# Altium schematic sheet NRF2401.SchDoc: NRF24L01-TX
size A4; SheetNumber: 3; SheetTotal: 5; DOC_NO_SCH_DWG: #022024031002
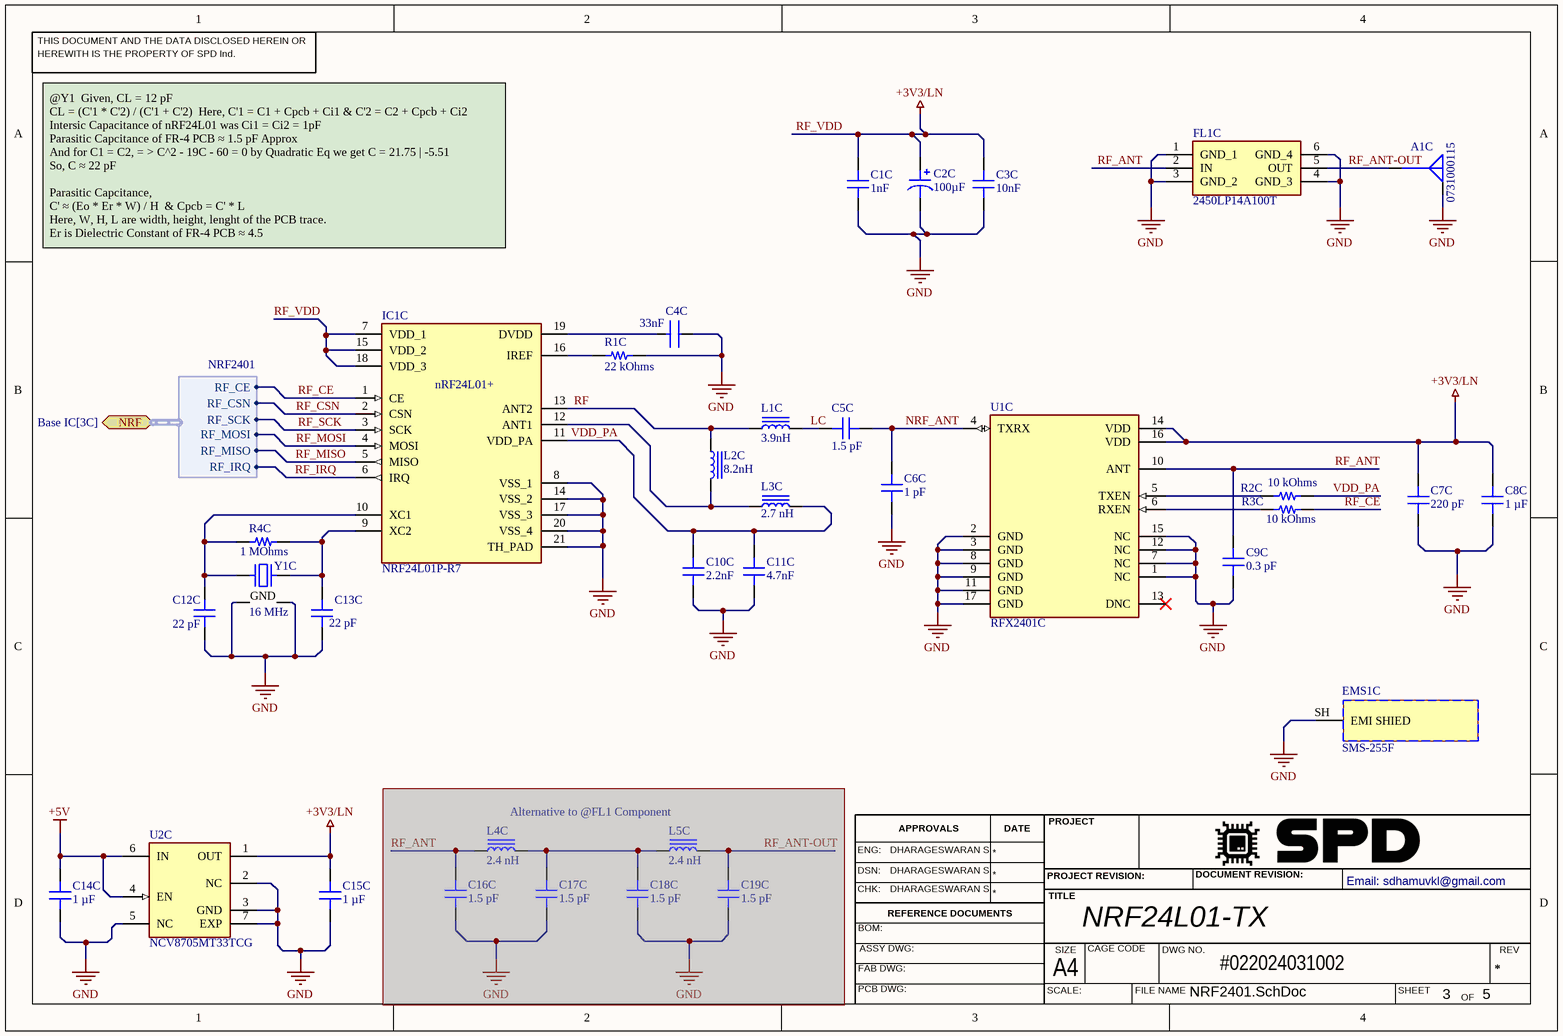
[diagram p0: NRF2401.SchDoc]

## Parts
A1C  0731000115  [MOLEX SD-73100-0115]
C1C  1nF  [CAP 0402_1005]
C2C  100µF  [CAP POL 1411_3528]
C3C  10nF  [CAP 0402_1005]
C4C  Capacitance: 33nF  [FP-CL101-IPC_C]  (hidden comment: CL05B333KO5NNNC)
C5C  1.5 pF  [CAP 0402_1005]
C6C  1 pF  [CAP 0402_1005]
C7C  220 pF  [CAP 0402_1005]
C8C  1 µF  [CAP 0402_1005]
C9C  0.3 pF  [CAP 0402_1005]
C10C  2.2nF  [CAP 0402_1005]
C11C  4.7nF  [CAP 0402_1005]
C12C  22 pF  [CAP 0402_1005]
C13C  22 pF  [CAP 0402_1005]
C14C  1 µF  [CAP 0402_1005]
C15C  1 µF  [CAP 0402_1005]
C16C  1.5 pF  [CAP 0402_1005]  (masked out: inside a compile mask, not in the netlist)
C17C  1.5 pF  [CAP 0402_1005]  (masked out: inside a compile mask, not in the netlist)
C18C  1.5 pF  [CAP 0402_1005]  (masked out: inside a compile mask, not in the netlist)
C19C  1.5 pF  [CAP 0402_1005]  (masked out: inside a compile mask, not in the netlist)
EMS1C  SMS-255F  [LEADERTECH_SMS-255F]
FL1C  2450LP14A100T  [2450LP14A100T]
IC1C  NRF24L01P-R7  [QFN50P400X400X95-21N-D]
L1C  3.9nH  [IND 0603_1608 RF WW]
L2C  8.2nH  [IND 0603_1608 RF WW]
L3C  2.7 nH  [IND 0402_1005 RF WW]
L4C  2.4 nH  [IND 0402_1005 RF WW]  (masked out: inside a compile mask, not in the netlist)
L5C  2.4 nH  [IND 0402_1005 RF WW]  (masked out: inside a compile mask, not in the netlist)
R1C  22 kOhms  [RES 0402_1005]
R2C  10 kOhms  [RES 0402_1005]
R3C  10 kOhms  [RES 0402_1005]
R4C  1 MOhms  [RES 0402_1005]
U1C  RFX2401C  [RFX2401C_SKY]
U2C  NCV8705MT33TCG  [FP-511BR-MFG]
Y1C  16 MHz  [NDK NX2520SA]

## Ports
NRF (bidir, harness NRF2401, see Base IC[3C])

## Harnesses
NRF2401: RF_CE, RF_CSN, RF_SCK, RF_MISO, RF_MOSI, RF_IRQ

## Nets
+5V: C14C.2 U2C.4(EN) U2C.6(IN)
GND: A1C.G C1C.1 C2C.2 C3C.1 C4C.2 C6C.1 C7C.1 C8C.2 C9C.1 C10C.1 C11C.1 C12C.1 C13C.1 C14C.1 C15C.1 EMS1C.SH(EMI_SHIED) FL1C.1(GND_1) FL1C.3(GND_2) FL1C.4(GND_3) FL1C.6(GND_4) IC1C.8(VSS_1) IC1C.14(VSS_2) IC1C.17(VSS_3) IC1C.20(VSS_4) IC1C.21(TH_PAD) R1C.1 U1C.1(NC) U1C.2(GND) U1C.3(GND) U1C.7(NC) U1C.8(GND) U1C.9(GND) U1C.11(GND) U1C.12(NC) U1C.15(NC) U1C.17(GND) U2C.2(NC) U2C.3(GND) U2C.5(NC) U2C.7(EXP) Y1C.2(GND) Y1C.4(GND)
RF_VDD: C1C.2 C2C.1 C3C.2 C7C.2 C8C.1 C15C.2 IC1C.7(VDD_1) IC1C.15(VDD_2) IC1C.18(VDD_3) U1C.14(VDD) U1C.16(VDD) U2C.1(OUT)  [also labelled +3V3/LN]
LC: C5C.1 L1C.2
NRF_ANT: C5C.2 C6C.2 U1C.4(TXRX)
RF: IC1C.13(ANT2) L1C.1 L2C.1
RF_ANT: C9C.2 FL1C.2(IN) U1C.10(ANT)
RF_ANT-OUT: A1C.S FL1C.5(OUT)
RF_CE: IC1C.1(CE) R3C.2 ; port NRF.RF_CE
RF_CSN: IC1C.2(CSN) ; port NRF.RF_CSN
RF_IRQ: IC1C.6(IRQ) ; port NRF.RF_IRQ
RF_MISO: IC1C.5(MISO) ; port NRF.RF_MISO
RF_MOSI: IC1C.4(MOSI) ; port NRF.RF_MOSI
RF_SCK: IC1C.3(SCK) ; port NRF.RF_SCK
VDD_PA: C10C.2 C11C.2 IC1C.11(VDD_PA) L3C.2 R2C.2
NetC4C_1: C4C.1 IC1C.19(DVDD)
NetC12C_2: C12C.2 IC1C.10(XC1) R4C.1 Y1C.1
NetC13C_2: C13C.2 IC1C.9(XC2) R4C.2 Y1C.3
NetIC1C_12: IC1C.12(ANT1) L2C.2 L3C.1
NetIC1C_16: IC1C.16(IREF) R1C.2
NetR2C_1: R2C.1 U1C.5(TXEN)
NetR3C_1: R3C.1 U1C.6(RXEN)

Not connected (* = marked no-connect by the designer): U1C 13(DNC)*

## Notes on the sheet
- @Y1  Given, CL = 12 pF
  CL = (C'1 * C'2) / (C'1 + C'2)  Here, C'1 = C1 + Cpcb + Ci1 & C'2 = C2 + Cpcb + Ci2
  Intersic Capacitance of nRF24L01 was Ci1 = Ci2 = 1pF
  Parasitic Capcitance of FR-4 PCB ≈ 1.5 pF Approx
  And for C1 = C2, = > C^2 - 19C - 60 = 0 by Quadratic Eq we get C = 21.75 | -5.51
  So, C ≈ 22 pF
  Parasitic Capcitance,
  C' ≈ (Eo * Er * W) / H  & Cpcb = C' * L
  Here, W, H, L are width, height, lenght of the PCB trace.
  Er is Dielectric Constant of FR-4 PCB ≈ 4.5
  So, C' ≈ 39.843 pF/m
- Alternative to @FL1 Component
- THIS DOCUMENT AND THE DATA DISCLOSED HEREIN OR
- HEREWITH IS THE PROPERTY OF SPD Ind.
- ENG:
- DHARAGESWARAN S
- APPROVALS
- DATE
- PROJECT
- DSN:
- CHK:
- REFERENCE DOCUMENTS
- PROJECT REVISION:
- TITLE
- DOCUMENT REVISION:
- Email: sdhamuvkl@gmail.com <https://github.com/DhamuVkl>
- BOM:
- FAB DWG:
- PCB DWG:
- ASSY DWG:
- SCALE:
- A4
- SIZE
- CAGE CODE
- FILE NAME
- DWG NO.
- SHEET
- REV
- OF
- (in symbol NRF24L01P-R7) nRF24L01+

## Library data of the parts
A1C = 0731000115: CONN SMA RCPT R/A 50 OHM PCB; Manufacturer: Molex; id: 4; Contact Termination: Solder; Connector Type: Receptacle, Female Socket; Number Of Ports: 1; Impedance: 50Ohm; Frequency - Max: 18 GHz; Part Number: 0731000115; Housing Color: Silver; Supplier Part Number 1: WM8552-ND; ComponentLink1Description: Datasheet; ComponentLink2URL: https://www.digikey.com/en/products/detail/molex/0731000115/3044674; ComponentLink1URL: https://www.molex.com/pdm_docs/sd/731000115_sd.pdf; Fastening Type: Threaded; Supplier 1: DigiKey; Series: 73100; Part Status: Active; Shield Termination: Solder; ComponentLink2Description: DigiKey Link; Packaging: Tray; Minimum Order: 1; Lifecycle Status: Active; LastUpdated: 2022-06-29T18:03:04.613; Connector Style: SMA; Mounting Type: Through Hole, Right Angle; Price: 2.95
C1C = C0402C102J3RECAUTO: CAP CER 0402 1NF 25V X7R 5%; Manufacturer: KEMET; id: 4189; Value: 1000 pF; Part Number: C0402C102J3RECAUTO; Temperature Coefficient: X7R; Supplier Part Number 1: 399-C0402C102J3RECAUTOCT-ND; ComponentLink2Description: DigiKey Link; ComponentLink1URL: https://api.kemet.com/component-edge/download/datasheet/C0402C102J3RECAUTO.pdf; PartId: 33620; Tolerance: ±5%; Supplier 1: DigiKey; Series: ESD SMD Auto X7R; LastUpdated: 2023-01-03T20:03:34.767; Part Status: Active; Capacitance: 1000 pF; Device Package: 0402 (1005 Metric); Ratings: AEC-Q200; Thickness (Max): 0.022" (0.55mm); Voltage - Rated: 25V; Minimum Order: 1; Packaging: TapeAndReel; Applications: Automotive, ESD Protection; Package / Case: 0402 (1005 Metric); ComponentLink1Description: Datasheet; Price: 0.02; ComponentLink2URL: https://www.digikey.com/en/products/detail/kemet/C0402C102J3RECAUTO/8646431; Lifecycle Status: Active; Operating Temperature: -55°C ~ 125°C; Size / Dimension: 0.039" L x 0.020" W (1.00mm x 0.50mm); Mounting Type: Surface Mount, MLCC
C2C = TPSB107K006R0250: CAP TANT 100UF 10% 6.3V 1411; Manufacturer: AVX Corporation; Manufacturer Size Code: B; id: 70; Type: Molded; Esr (Equivalent Series Resistance): 250mOhm; Part Number: TPSB107K006R0250; Value: 100µF; Height - Seated (Max): 0.083" (2.10mm); Supplier Part Number 1: 478-3080-1-ND; ComponentLink2Description: DigiKey Link; Features: General Purpose; ComponentLink1URL: http://datasheets.avx.com/TPS.pdf; PartId: 70; Tolerance: ±10%; Supplier 1: DigiKey; Series: TPS; LastUpdated: 2020-09-02T01:15:45.860; Part Status: Active; Capacitance: 100µF; Voltage - Rated: 6.3V; Minimum Order: 1; Packaging: TapeAndReel; Package / Case: 1411 (3528 Metric), 1210; ComponentLink1Description: Datasheet; Price: 0.13; ComponentLink2URL: http://digikey.com/product-detail/en/avx-corporation/TPSB107K006R0250/478-3080-1-ND/809593; Lifecycle Status: Active; Operating Temperature: -55°C ~ 125°C; Size / Dimension: 0.138" L x 0.110" W (3.50mm x 2.80mm); Mounting Type: Surface Mount
C3C = C0402C103J5RECAUTO: CAP CER 0402 10NF 50V X7R 5%; Manufacturer: KEMET; id: 3927; Value: 10000 pF; Part Number: C0402C103J5RECAUTO; Temperature Coefficient: X7R; Supplier Part Number 1: 399-C0402C103J5RECAUTOCT-ND; ComponentLink2Description: DigiKey Link; ComponentLink1URL: https://api.kemet.com/component-edge/download/datasheet/C0402C103J5RECAUTO.pdf; PartId: 33153; Tolerance: ±5%; Supplier 1: DigiKey; Series: ESD SMD Auto X7R; LastUpdated: 2023-01-03T20:03:32.240; Part Status: Active; Capacitance: 10000 pF; Device Package: 0402 (1005 Metric); Ratings: AEC-Q200; Thickness (Max): 0.022" (0.55mm); Voltage - Rated: 50V; Minimum Order: 1; Packaging: TapeAndReel; Applications: Automotive, ESD Protection; Package / Case: 0402 (1005 Metric); ComponentLink1Description: Datasheet; Price: 0.02; ComponentLink2URL: https://www.digikey.com/en/products/detail/kemet/C0402C103J5RECAUTO/8646448; Lifecycle Status: Active; Operating Temperature: -55°C ~ 125°C; Size / Dimension: 0.039" L x 0.020" W (1.00mm x 0.50mm); Mounting Type: Surface Mount, MLCC
C4C = CMP-13271-004220-1: Cap Ceramic 33nF 16V X7R ±10% SMD 0402 +125°C Paper T/R; Dielectric: X7R; Mount: Surface Mount; Depth: 0.5mm; Case/Package: 0402; Packaging: Tape and Reel; Height: 0.5mm; Voltage: 16V; Radiation Hardening: No; Length: 1mm; Case Code (Imperial): 0402; Tolerance: 10%; Max Operating Temperature: 125°C; Width: 0.02inch; Voltage Rating (DC): 16V; Case Code (Metric): 1005; Lead Free: Lead Free; Voltage Rating: 16V; Thickness: 0.022inch; Min Operating Temperature: -55°C
C5C C16C C17C C18C C19C = GJM1555C1H1R5WB01D: CAP CER 1.5PF 50V C0G/NP0 0402; Manufacturer: Murata Electronics; id: 1437; Temperature Coefficient: C0G, NP0; Tolerance: ±0.05pF; Part Number: GJM1555C1H1R5WB01D; Value: 1.5 pF; Supplier Part Number 1: 490-11199-1-ND; ComponentLink2Description: DigiKey Link; Features: High Q, Low Loss; ComponentLink1URL: https://search.murata.co.jp/Ceramy/image/img/A01X/G101/ENG/GJM1555C1H1R5WB01-01.pdf; PartId: 5918; Supplier 1: DigiKey; Series: GJM; LastUpdated: 2023-01-03T20:04:06.813; Part Status: Active; Capacitance: 1.5 pF; Device Package: 0402 (1005 Metric); Thickness (Max): 0.022" (0.55mm); Voltage - Rated: 50V; Minimum Order: 1; Packaging: TapeAndReel; Applications: RF, Microwave, High Frequency; Package / Case: 0402 (1005 Metric); ComponentLink1Description: Datasheet; Price: 0.02; ComponentLink2URL: https://www.digikey.com/en/products/detail/murata-electronics/GJM1555C1H1R5WB01D/2592890; Lifecycle Status: Active; Operating Temperature: -55°C ~ 125°C; Size / Dimension: 0.039" L x 0.020" W (1.00mm x 0.50mm); Mounting Type: Surface Mount, MLCC
C6C = VJ0402A1R0BXQPW1BC: CAP CER 1PF 10V C0G/NP0 0402; Manufacturer: Vishay Vitramon; id: 3394; Temperature Coefficient: C0G, NP0; Tolerance: ±0.1pF; Part Number: VJ0402A1R0BXQPW1BC; Value: 1 pF; Supplier Part Number 1: 720-VJ0402A1R0BXQPW1BCCT-ND; ComponentLink2Description: DigiKey Link; ComponentLink1URL: https://www.vishay.com/docs/28548/vjw1bcbascomseries.pdf; PartId: 26167; Supplier 1: DigiKey; Series: VJ; LastUpdated: 2023-01-03T20:03:41.757; Part Status: Active; Capacitance: 1 pF; Device Package: 0402 (1005 Metric); Thickness (Max): 0.022" (0.55mm); Voltage - Rated: 10V; Minimum Order: 1; Packaging: TapeAndReel; Applications: General Purpose; Package / Case: 0402 (1005 Metric); ComponentLink1Description: Datasheet; Price: 0.01; ComponentLink2URL: https://www.digikey.com/en/products/detail/vishay-vitramon/VJ0402A1R0BXQPW1BC/8301012; Lifecycle Status: Active; Operating Temperature: -55°C ~ 125°C; Size / Dimension: 0.039" L x 0.020" W (1.00mm x 0.50mm); Mounting Type: Surface Mount, MLCC
C7C = KGM05ACG1H221FH: CAP CER 220PF 50V NP0 0402; Manufacturer: KYOCERA AVX; id: 6699; Temperature Coefficient: C0G, NP0; Tolerance: ±1%; Part Number: KGM05ACG1H221FH; Value: 220 pF; Supplier Part Number 1: 478-KGM05ACG1H221FHCT-ND; ComponentLink2Description: DigiKey Link; ComponentLink1URL: https://datasheets.kyocera-avx.com/C0GNP0-Dielectric.pdf; PartId: 50371; Supplier 1: DigiKey; Series: -; LastUpdated: 2023-05-20T19:03:18.857; Part Status: Active; Capacitance: 220 pF; Device Package: 0402 (1005 Metric); Thickness (Max): 0.022" (0.56mm); Voltage - Rated: 50V; Minimum Order: 1; Packaging: TapeAndReel; Applications: General Purpose; Package / Case: 0402 (1005 Metric); ComponentLink1Description: Datasheet; Price: 0.05; ComponentLink2URL: https://www.digikey.com/en/products/detail/kyocera-avx/KGM05ACG1H221FH/1597432; Lifecycle Status: Active; Operating Temperature: -55°C ~ 125°C; Size / Dimension: 0.039" L x 0.020" W (1.00mm x 0.50mm); Mounting Type: Surface Mount, MLCC
C8C C14C C15C = GRM155C81C105KE11D: CAP CER 1UF 16V X6S 0402; Manufacturer: Murata Electronics; id: 824; Tolerance: ±10%; Part Number: GRM155C81C105KE11D; Value: 1 µF; Temperature Coefficient: X6S; Supplier Part Number 1: 490-12700-1-ND; ComponentLink2Description: DigiKey Link; ComponentLink1URL: https://search.murata.co.jp/Ceramy/image/img/A01X/G101/ENG/GRM155C81C105KE11-01.pdf; PartId: 3683; Supplier 1: DigiKey; Series: GRM; LastUpdated: 2023-01-03T20:04:13.167; Part Status: Active; Capacitance: 1 µF; Device Package: 0402 (1005 Metric); Thickness (Max): 0.024" (0.60mm); Voltage - Rated: 16V; Minimum Order: 1; Packaging: TapeAndReel; Applications: General Purpose; Package / Case: 0402 (1005 Metric); ComponentLink1Description: Datasheet; Price: 0.01; ComponentLink2URL: https://www.digikey.com/en/products/detail/murata-electronics/GRM155C81C105KE11D/4905091; Lifecycle Status: Active; Operating Temperature: -55°C ~ 105°C; Size / Dimension: 0.039" L x 0.020" W (1.00mm x 0.50mm); Mounting Type: Surface Mount, MLCC
C9C = QSCF500Q0R3A1GV001T: CAP CER 0.3PF 50V C0G/NP0 0402; Manufacturer: Johanson Technology Inc.; id: 6223; Temperature Coefficient: C0G, NP0; Tolerance: ±0.05pF; Part Number: QSCF500Q0R3A1GV001T; Value: 0.3 pF; Supplier Part Number 1: 712-QSCF500Q0R3A1GV001TCT-ND; ComponentLink2Description: DigiKey Link; Features: High Q, Low Loss, Ultra Low ESR; ComponentLink1URL: https://www.johansontechnology.com/downloads/catalog/johanson-technology-multi-layer-high-q-capacitors.pdf; PartId: 47766; Supplier 1: DigiKey; Series: S; LastUpdated: 2023-04-03T19:03:42.407; Part Status: Active; Capacitance: 0.3 pF; Device Package: 0402 (1005 Metric); Thickness (Max): 0.024" (0.61mm); Voltage - Rated: 50V; Minimum Order: 1; Packaging: TapeAndReel; Applications: RF, Microwave, High Frequency; Package / Case: 0402 (1005 Metric); ComponentLink1Description: Datasheet; Price: 0.02; ComponentLink2URL: https://www.digikey.com/en/products/detail/johanson-technology-inc/QSCF500Q0R3A1GV001T/1561513; Lifecycle Status: Active; Operating Temperature: -55°C ~ 125°C; Size / Dimension: 0.040" L x 0.020" W (1.02mm x 0.51mm); Mounting Type: Surface Mount, MLCC
C10C = C0402C222J3GEC7411: CAP CER 0402 2.2NF 25V C0G 5%; Manufacturer: KEMET; id: 4180; Value: 2200 pF; Temperature Coefficient: C0G, NP0; Part Number: C0402C222J3GEC7411; Supplier Part Number 1: 399-C0402C222J3GEC7411CT-ND; ComponentLink2Description: DigiKey Link; Features: Low ESL; ComponentLink1URL: https://api.kemet.com/component-edge/download/datasheet/C0402C222J3GEC7411.pdf; PartId: 33604; Tolerance: ±5%; Supplier 1: DigiKey; Series: ESD SMD Comm C0G; LastUpdated: 2023-01-03T20:03:34.670; Part Status: Active; Capacitance: 2200 pF; Device Package: 0402 (1005 Metric); Thickness (Max): 0.022" (0.55mm); Voltage - Rated: 25V; Minimum Order: 1; Packaging: TapeAndReel; Applications: ESD Protection; Package / Case: 0402 (1005 Metric); ComponentLink1Description: Datasheet; Price: 0.01; ComponentLink2URL: https://www.digikey.com/en/products/detail/kemet/C0402C222J3GEC7411/8645834; Lifecycle Status: Active; Operating Temperature: -55°C ~ 125°C; Size / Dimension: 0.039" L x 0.020" W (1.00mm x 0.50mm); Mounting Type: Surface Mount, MLCC
C11C = C0402C472K5RECAUTO: CAP CER 0402 4.7NF 50V X7R 10%; Manufacturer: KEMET; id: 3941; Value: 4700 pF; Part Number: C0402C472K5RECAUTO; Temperature Coefficient: X7R; Supplier Part Number 1: 399-C0402C472K5RECAUTOCT-ND; ComponentLink2Description: DigiKey Link; ComponentLink1URL: https://api.kemet.com/component-edge/download/datasheet/C0402C472K5RECAUTO.pdf; PartId: 33184; Tolerance: ±10%; Supplier 1: DigiKey; Series: ESD SMD Auto X7R; LastUpdated: 2023-01-03T20:03:32.387; Part Status: Active; Capacitance: 4700 pF; Device Package: 0402 (1005 Metric); Ratings: AEC-Q200; Thickness (Max): 0.022" (0.55mm); Voltage - Rated: 50V; Minimum Order: 1; Packaging: TapeAndReel; Applications: Automotive, ESD Protection; Package / Case: 0402 (1005 Metric); ComponentLink1Description: Datasheet; Price: 0.01; ComponentLink2URL: https://www.digikey.com/en/products/detail/kemet/C0402C472K5RECAUTO/8646475; Lifecycle Status: Active; Operating Temperature: -55°C ~ 125°C; Size / Dimension: 0.039" L x 0.020" W (1.00mm x 0.50mm); Mounting Type: Surface Mount, MLCC
C12C C13C = 0402N220J250CT: CAP CER 22PF 25V C0G/NP0 0402; Manufacturer: Walsin Technology Corporation; id: 507; Temperature Coefficient: C0G, NP0; Tolerance: ±5%; Part Number: 0402N220J250CT; Value: 22 pF; Supplier Part Number 1: 1292-1282-1-ND; ComponentLink2Description: DigiKey Link; ComponentLink1URL: http://www.passivecomponent.com/wp-content/uploads/2018/10/MLCC.pdf; PartId: 2676; Supplier 1: DigiKey; Series: -; LastUpdated: 2023-01-03T20:04:15.580; Part Status: Active; Capacitance: 22 pF; Device Package: 0402 (1005 Metric); Thickness (Max): 0.022" (0.55mm); Voltage - Rated: 25V; Minimum Order: 1; Packaging: CutTape; Applications: General Purpose; Package / Case: 0402 (1005 Metric); ComponentLink1Description: Datasheet; Price: 0.01; ComponentLink2URL: https://www.digikey.com/en/products/detail/walsin-technology-corporation/0402N220J250CT/9354779; Lifecycle Status: Active; Operating Temperature: -55°C ~ 125°C; Size / Dimension: 0.039" L x 0.020" W (1.00mm x 0.50mm); Mounting Type: Surface Mount, MLCC
EMS1C = SMS-255F: RF Shield Frame 0.750 (19.05mm) X 0.750 (19.05mm) - Surface Mount; MF: Leader Tech; SnapEDA_Link: https://www.snapeda.com/parts/SMS-255F/Leader+Tech+Inc./view-part/?ref=snap; Package: None; Value: *; MP: SMS-255F; Check_prices: https://www.snapeda.com/parts/SMS-255F/Leader+Tech+Inc./view-part/?ref=eda
FL1C = 2450LP14A100T: Filter; Manufacturer_Name: JOHANSON TECHNOLOGY; Datasheet Link: https://componentsearchengine.com/Datasheets/1/2450LP14A100T.pdf; Height: 0.7mm; Manufacturer_Part_Number: 2450LP14A100T; Mouser Part Number: 609-2450LP14A100T; Mouser Price/Stock: https://www.mouser.co.uk/ProductDetail/Johanson-Technology/2450LP14A100T?qs=yCnrNFeXz%252BgP94nTCDCKIA%3D%3D; Arrow Part Number: 2450LP14A100T; Arrow Price/Stock: https://www.arrow.com/en/products/2450lp14a100t/johanson-dielectrics?region=nac; Supplier 1: Mouser; Supplier Part Number 1: 609-2450LP14A100T
IC1C = NRF24L01P-R7: Integrated Circuit; Manufacturer_Name: Nordic Semiconductor; Datasheet Link: https://www.mouser.com/ds/2/297/nRF24L01P-1187709.pdf; Height: 0.95mm; Manufacturer_Part_Number: NRF24L01P-R7; Mouser Part Number: 949-NRF24L01P-R7; Mouser Price/Stock: https://www.mouser.co.uk/ProductDetail/Nordic-Semiconductor/nRF24L01P-R7?qs=yd0qOhnSiDe8zMRXiZkGiQ%3D%3D; Arrow Part Number: NRF24L01P-R7; Arrow Price/Stock: null?region=nac; Supplier 1: Avnet; Supplier Part Number 1: NRF24L01P-R7
L1C = LQW18AS3N9G0ZD: FIXED IND 3.9NH 700MA 80 MOHM; Manufacturer: Murata Electronics; id: 1055; Frequency - Self Resonant: 6.9GHz; Tolerance: ±2%; Type: Wirewound; Inductance Frequency - Test: 250MHz; Q @ Freq: 22 @ 250MHz; Material - Core: Non-Magnetic; DC Resistance (DCR): 80mOhm Max; Shielding: Unshielded; Part Number: LQW18AS3N9G0ZD; Height - Seated (Max): 0.039" (1.00mm); Supplier Part Number 1: 490-15828-1-ND; Current Rating (Amps): 700mA; Supplier Device Package: 0603 (1608 Metric); Inductance: 3.9nH; ComponentLink1Description: Datasheet; ComponentLink2URL: http://digikey.com/product-detail/en/murata-electronics/LQW18AS3N9G0ZD/490-15828-1-ND/6800493; ComponentLink1URL: https://search.murata.co.jp/Ceramy/image/img/P02/JELF243A-9139.pdf; Supplier 1: DigiKey; Series: LQW18; Part Status: Active; ComponentLink2Description: DigiKey Link; Device Package: 0603 (1608 Metric); Packaging: TapeAndReel; Ratings: AEC-Q200; Minimum Order: 1; Package / Case: 0603 (1608 Metric); PartId: 1055; Lifecycle Status: Active; LastUpdated: 2020-09-06T11:05:18.113; Operating Temperature: -55°C ~ 125°C; Value: 3.9nH; Size / Dimension: 0.063" L x 0.031" W (1.60mm x 0.80mm); Mounting Type: Surface Mount; Price: 0.08
L2C = LQW18AS8N2G0ZD: FIXED IND 8.2NH 700MA 115 MOHM; Manufacturer: Murata Electronics; id: 999; Frequency - Self Resonant: 4.2GHz; Tolerance: ±2%; Type: Wirewound; Inductance Frequency - Test: 250MHz; Q @ Freq: 30 @ 250MHz; Material - Core: Non-Magnetic; DC Resistance (DCR): 115mOhm Max; Shielding: Unshielded; Part Number: LQW18AS8N2G0ZD; Height - Seated (Max): 0.039" (1.00mm); Supplier Part Number 1: 490-15856-1-ND; Current Rating (Amps): 700mA; Supplier Device Package: 0603 (1608 Metric); Inductance: 8.2nH; ComponentLink1Description: Datasheet; ComponentLink2URL: http://digikey.com/product-detail/en/murata-electronics/LQW18AS8N2G0ZD/490-15856-1-ND/6800521; ComponentLink1URL: https://search.murata.co.jp/Ceramy/image/img/P02/JELF243A-9139.pdf; Supplier 1: DigiKey; Series: LQW18; Part Status: Active; ComponentLink2Description: DigiKey Link; Device Package: 0603 (1608 Metric); Packaging: TapeAndReel; Ratings: AEC-Q200; Minimum Order: 1; Package / Case: 0603 (1608 Metric); PartId: 999; Lifecycle Status: Active; LastUpdated: 2020-09-06T11:05:17.697; Operating Temperature: -55°C ~ 125°C; Value: 8.2nH; Size / Dimension: 0.063" L x 0.031" W (1.60mm x 0.80mm); Mounting Type: Surface Mount; Price: 0.08
L3C = LQW15AN2N7G8ZD: FIXED IND 2.7NH 1.5A 47MOHM SMD; Manufacturer: Murata Electronics; id: 106; Frequency - Self Resonant: 14GHz; Tolerance: ±2%; Type: Wirewound; Inductance Frequency - Test: 100 MHz; Q @ Freq: 28 @ 250MHz; Material - Core: Non-Magnetic; DC Resistance (DCR): 47mOhm Max; Shielding: Unshielded; Part Number: LQW15AN2N7G8ZD; Height - Seated (Max): 0.024" (0.60mm); Supplier Part Number 1: 490-15398-1-ND; Current Rating (Amps): 1.5 A; Supplier Device Package: 0402 (1005 Metric); Inductance: 2.7 nH; ComponentLink1Description: Datasheet; ComponentLink2URL: https://www.digikey.com/en/products/detail/murata-electronics/LQW15AN2N7G8ZD/6798823; ComponentLink1URL: https://search.murata.co.jp/Ceramy/image/img/P02/JELF243A-9138.pdf; Supplier 1: DigiKey; Series: LQW15; Part Status: Active; ComponentLink2Description: DigiKey Link; Device Package: 0402 (1005 Metric); Packaging: TapeAndReel; Ratings: AEC-Q200; Minimum Order: 1; Package / Case: 0402 (1005 Metric); PartId: 106; Lifecycle Status: Active; LastUpdated: 2023-01-02T20:59:33.170; Operating Temperature: -55°C ~ 125°C; Value: 2.7 nH; Size / Dimension: 0.039" L x 0.024" W (1.00mm x 0.60mm); Mounting Type: Surface Mount; Price: 0.07
L4C L5C = LQW15AN2N4G80D: FIXED IND 2.4NH 2.53A 22MOHM SMD; Manufacturer: Murata Electronics; id: 1601; Frequency - Self Resonant: 15.5GHz; Tolerance: ±2%; Type: Wirewound; Inductance Frequency - Test: 100 MHz; Q @ Freq: 30 @ 250MHz; Material - Core: Non-Magnetic; DC Resistance (DCR): 22mOhm Max; Shielding: Unshielded; Part Number: LQW15AN2N4G80D; Height - Seated (Max): 0.024" (0.60mm); Supplier Part Number 1: 490-LQW15AN2N4G80DCT-ND; Current Rating (Amps): 2.53 A; Supplier Device Package: 0402; Inductance: 2.4 nH; ComponentLink1Description: Datasheet; ComponentLink2URL: https://www.digikey.com/en/products/detail/murata-electronics/LQW15AN2N4G80D/9815978; ComponentLink1URL: https://search.murata.co.jp/Ceramy/image/img/P02/JELF243A-0100.pdf; Supplier 1: DigiKey; Series: LQW15; Part Status: Active; ComponentLink2Description: DigiKey Link; Device Package: 0402 (1005 Metric); Packaging: TapeAndReel; Ratings: AEC-Q200; Minimum Order: 1; Package / Case: 0402 (1005 Metric); PartId: 1601; Lifecycle Status: Active; LastUpdated: 2023-04-30T20:10:30.157; Operating Temperature: -55°C ~ 125°C; Value: 2.4 nH; Size / Dimension: 0.039" L x 0.024" W (1.00mm x 0.60mm); Mounting Type: Surface Mount; Price: 0.07
R1C = AC0402FR-1322KL: RES 22K OHM 1% 1/16W 0402; Manufacturer: Yageo; id: 12344; Temperature Coefficient: ±100ppm/°C; Power (Watts): 0.063W, 1/16W; Part Number: AC0402FR-1322KL; Height - Seated (Max): 0.015" (0.37mm); Supplier Part Number 1: 13-AC0402FR-1322KLCT-ND; Supplier Device Package: 0402; ComponentLink1Description: Datasheet; ComponentLink2URL: https://www.digikey.com/en/products/detail/yageo/AC0402FR-1322KL/14008249; ComponentLink1URL: https://www.yageo.com/upload/media/product/productsearch/datasheet/rchip/PYu-AC_51_RoHS_L_8.pdf; Composition: Thick Film; Tolerance: ±1%; Supplier 1: DigiKey; Series: AC; Part Status: Active; ComponentLink2Description: DigiKey Link; Device Package: 0402 (1005 Metric); Packaging: CutTape; Ratings: AEC-Q200; Minimum Order: 1; Package / Case: 0402 (1005 Metric); PartId: 65198; Lifecycle Status: Active; LastUpdated: 2023-01-02T20:20:07.897; Operating Temperature: -55°C ~ 155°C; Number Of Terminations: 2; Value: 22 kOhms; Size / Dimension: 0.039" L x 0.020" W (1.00mm x 0.50mm); Price: 0.01; Resistance: 22 kOhms
R2C R3C = AC0402FR-1310KL: RES 10K OHM 1% 1/16W 0402; Manufacturer: Yageo; id: 13132; Temperature Coefficient: ±100ppm/°C; Power (Watts): 0.063W, 1/16W; Part Number: AC0402FR-1310KL; Height - Seated (Max): 0.015" (0.37mm); Supplier Part Number 1: 13-AC0402FR-1310KLCT-ND; Supplier Device Package: 0402; ComponentLink1Description: Datasheet; ComponentLink2URL: https://www.digikey.com/en/products/detail/yageo/AC0402FR-1310KL/12756397; Features: Automotive AEC-Q200, Moisture Resistant; ComponentLink1URL: https://www.yageo.com/upload/media/product/productsearch/datasheet/rchip/PYu-AC_51_RoHS_L_8.pdf; Composition: Thick Film; Tolerance: ±1%; Supplier 1: DigiKey; Series: AC; Part Status: Active; ComponentLink2Description: DigiKey Link; Device Package: 0402 (1005 Metric); Packaging: CutTape; Ratings: AEC-Q200; Minimum Order: 1; Package / Case: 0402 (1005 Metric); PartId: 69220; Lifecycle Status: Active; LastUpdated: 2023-01-02T20:19:54.633; Operating Temperature: -55°C ~ 155°C; Number Of Terminations: 2; Value: 10 kOhms; Size / Dimension: 0.039" L x 0.020" W (1.00mm x 0.50mm); Price: 0.01; Resistance: 10 kOhms
R4C = AC0402FR-071ML: RES SMD 1M OHM 1% 1/16W 0402; Manufacturer: Yageo; id: 4991; Temperature Coefficient: ±100ppm/°C; Power (Watts): 0.063W, 1/16W; Part Number: AC0402FR-071ML; Height - Seated (Max): 0.015" (0.37mm); Supplier Part Number 1: YAG3450CT-ND; Supplier Device Package: 0402; ComponentLink1Description: Datasheet; ComponentLink2URL: https://www.digikey.com/en/products/detail/yageo/AC0402FR-071ML/5895164; Features: Automotive AEC-Q200, Moisture Resistant; ComponentLink1URL: https://www.yageo.com/upload/media/product/productsearch/datasheet/rchip/PYu-AC_51_RoHS_L_7.pdf; Composition: Thick Film; Tolerance: ±1%; Supplier 1: DigiKey; Series: AC; Part Status: Active; ComponentLink2Description: DigiKey Link; Device Package: 0402 (1005 Metric); Packaging: CutTape; Ratings: AEC-Q200; Minimum Order: 1; Package / Case: 0402 (1005 Metric); PartId: 12043; Lifecycle Status: Active; LastUpdated: 2023-01-02T20:21:09.883; Operating Temperature: -55°C ~ 155°C; Number Of Terminations: 2; Value: 1 MOhms; Size / Dimension: 0.039" L x 0.020" W (1.00mm x 0.50mm); Price: 0.01; Resistance: 1 MOhms
U1C = RFX2401C: No Description Available; Mfr_Name: Skyworks; RefDes: RefDes; Type: Type
U2C = CMP-07128-000006-2: IC REG LINEAR 3.3V 500MA 6WDFN; Number of Outputs: 1; Min Input Voltage: 2.5V; Accuracy: 2%; Min Current Limit: 510mA; Polarity: Positive; Output Type: Fixed; Quiescent Current: 25uA; Dropout Voltage: 230mV; Max Input Voltage: 5.5V; Number of Pins: 6; Mount: Surface Mount; Package Quantity: 3000; Lead Free: Lead Free; Radiation Hardening: No; Min Operating Temperature: -40°C; Number of Regulators: 1; Max Operating Temperature: 125°C; Output Current: 500mA; Max Output Current: 500mA; Packaging: Tape and Reel; Output Voltage: 3.3V
Y1C = NX2520SA-16MHZ-EXS00A-CS05116: CRYSTAL 16.0000MHZ 12PF SMD; Manufacturer: NDK America, Inc.; id: 522; Frequency Tolerance: ±15ppm; Operating Mode: Fundamental; Esr (Equivalent Series Resistance): 80 Ohms; Part Number: NX2520SA-16MHZ-EXS00A-CS05116; Height - Seated (Max): 0.022" (0.55mm); Supplier Part Number 1: 644-1200-1-ND; ComponentLink1Description: Datasheet; ComponentLink2URL: https://www.digikey.com/en/products/detail/ndk-america-inc/NX2520SA-16MHZ-EXS00A-CS05116/3894065; ComponentLink1URL: //media.digikey.com/pdf/Data%20Sheets/NDK%20PDFs/NX2520SA-16MHZ-EXS00A-CS05116.pdf; Supplier 1: DigiKey; Frequency: 16 MHz; Series: NX2520SA; Part Status: Active; Type: MHz Crystal; ComponentLink2Description: DigiKey Link; Packaging: TapeAndReel; Frequency Stability: ±15ppm; Minimum Order: 1; Package / Case: 4-SMD, No Lead; PartId: 522; Lifecycle Status: Active; LastUpdated: 2023-01-02T20:58:22.490; Operating Temperature: -10°C ~ 75°C; Value: 16 MHz; Size / Dimension: 0.098" L x 0.079" W (2.50mm x 2.00mm); Mounting Type: Surface Mount; Price: 0.74; Load Capacitance: 12pF